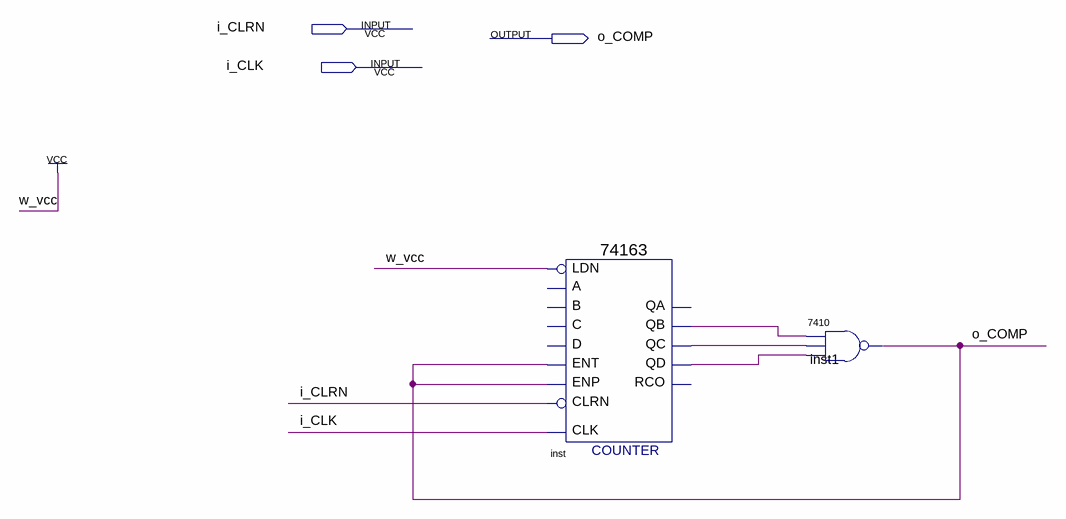
[diagram p0: schematic sheet]
// Quartus schematic counter_15.bdf as structural Verilog: 2 symbols, 3 pins
module counter_15 (
  input  i_CLRN,
  input  i_CLK,
  output o_COMP
);

  wire inst_qb, inst_qc, inst_qd;

  \74163  inst (
    .ENT(o_COMP), .CLRN(i_CLRN), .CLK(i_CLK), .ENP(o_COMP), .LDN(1'b1), .QB(inst_qb), .QC(inst_qc),
    .QD(inst_qd));  // open: C, B, A, D, QA, RCO
  \7410  inst1 (.\2 (inst_qb), .\3 (inst_qc), .\4 (inst_qd), .\1 (o_COMP));
endmodule
